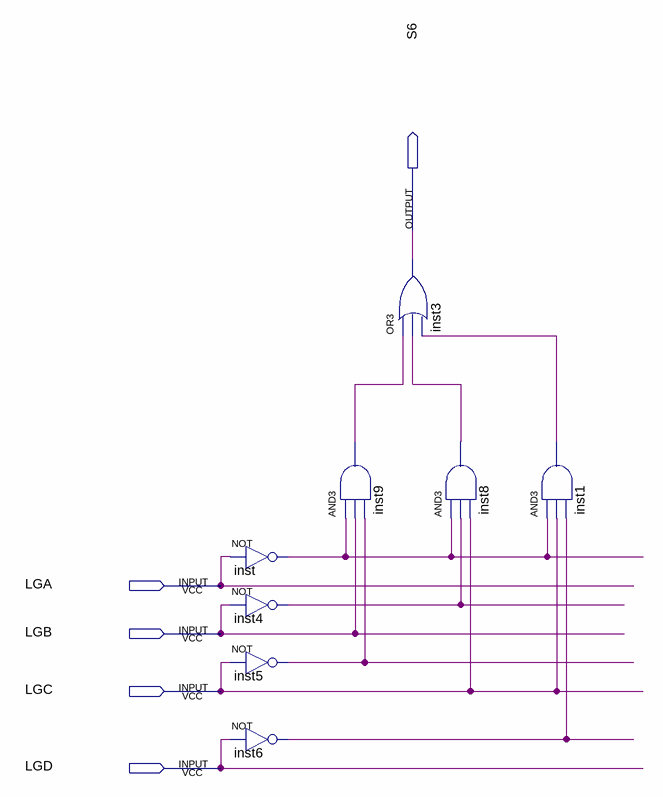
[diagram p0: schematic sheet]
// Quartus schematic Linha6.bdf as structural Verilog: 8 symbols, 5 pins
module Linha6 (
  input  LGA,
  input  LGB,
  input  LGC,
  input  LGD,
  output S6
);

  wire inst1_out, inst4_out, inst5_out, inst6_out, inst8_out, inst9_out, inst_out;

  not inst (inst_out, LGA);
  not inst4 (inst4_out, LGB);
  not inst5 (inst5_out, LGC);
  not inst6 (inst6_out, LGD);
  or inst3 (S6, inst9_out, inst8_out, inst1_out);
  and inst9 (inst9_out, inst_out, LGB, inst5_out);
  and inst8 (inst8_out, inst_out, inst4_out, LGC);
  and inst1 (inst1_out, inst_out, LGC, inst6_out);
endmodule
